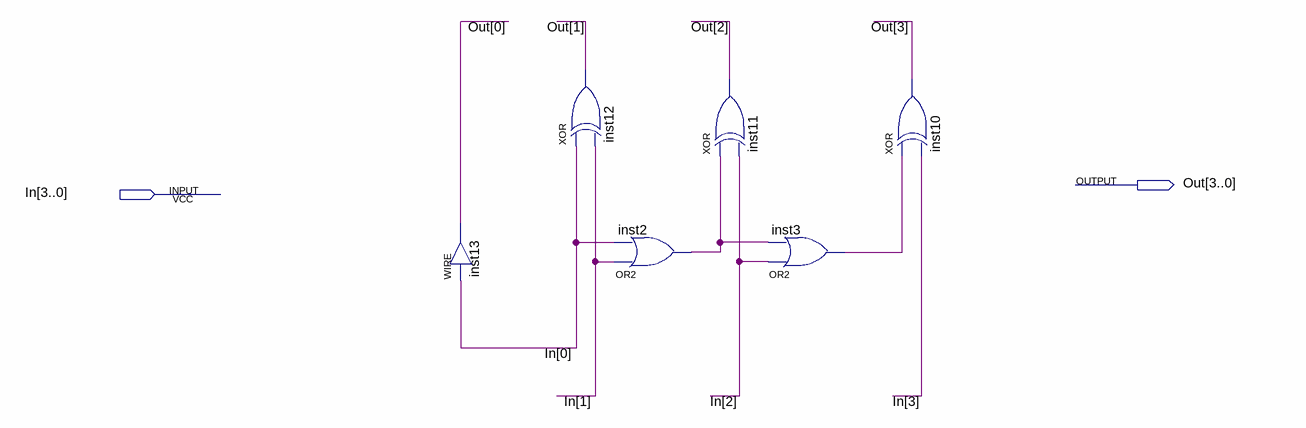
[diagram p0: schematic sheet]
// Quartus schematic C4.bdf as structural Verilog: 6 symbols, 2 pins
module C4 (
  input  [3:0] In,
  output [3:0] Out
);

  wire inst2_out, inst3_out;

  assign Out[0] = In[0];  // WIRE inst13
  xor inst12 (Out[1], In[0], In[1]);
  or inst2 (inst2_out, In[1], In[0]);
  xor inst11 (Out[2], inst2_out, In[2]);
  or inst3 (inst3_out, In[2], inst2_out);
  xor inst10 (Out[3], inst3_out, In[3]);
endmodule
